# Altium schematic sheet MCU.SchDoc
size A
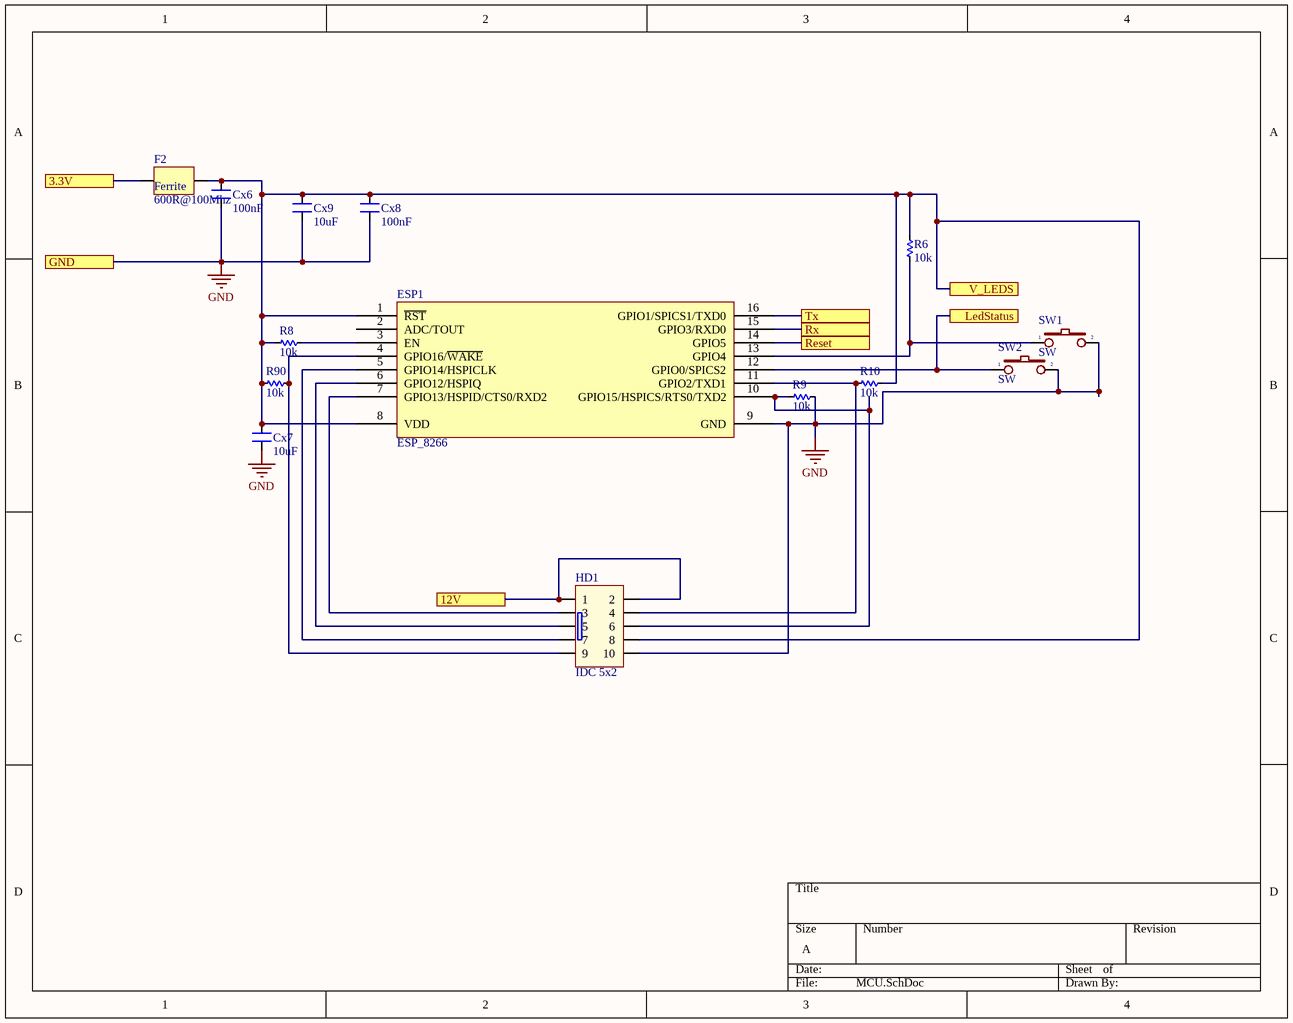
[diagram p0: MCU.SchDoc]

## Parts
Cx6  100nF  [CN-SMD-0805]
Cx7  10uF  [CN-SMD-0805]
Cx8  100nF  [CN-SMD-0805]
Cx9  10uF  [CN-SMD-0805]
ESP1  ESP_8266  [ESP12_small]
F2  600R@100Mhz  [Capacitor_805]
HD1  IDC 5x2  [IDC10-BH]
R6  10k  [RES-SMD-0805]
R8  10k  [RES-SMD-0805]
R9  10k  [RES-SMD-0805]
R10  10k  [RES-SMD-0805]
R90  10k  [RES-SMD-0805]
SW1  SW  [SW1-DIP]
SW2  SW  [SW1-SMD]

## Ports
3.3V, 12V, GND, LedStatus, Reset, Rx, Tx, V_LEDS

## Nets
GND: Cx6.1 Cx7.2 Cx8.1 Cx9.1 ESP1.9(GND) HD1.10 R9.1 SW1.2 SW2.2 ; port GND
3.3V: F2.1 ; port 3.3V
12V: HD1.1 HD1.2 ; port 12V
LedStatus: ESP1.12(GPIO0/SPICS2) SW2.1 ; port LedStatus
Reset: ESP1.14(GPIO5) ; port Reset
Rx: ESP1.15(GPIO3/RXD0) ; port Rx
Tx: ESP1.16(GPIO1/SPICS1/TXD0) ; port Tx
V_LEDS: Cx6.2 Cx7.1 Cx8.2 Cx9.2 ESP1.1(~{RST}) ESP1.8(VDD) F2.2 HD1.8 R6.1 R8.2 R10.1 R90.2 ; port V_LEDS
NetESP1_3: ESP1.3(EN) R8.1
NetESP1_4: ESP1.4(GPIO16/~{WAKE}) HD1.9 R90.1
NetESP1_5: ESP1.5(GPIO14/HSPICLK) HD1.7
NetESP1_6: ESP1.6(GPIO12/HSPIQ) HD1.5
NetESP1_7: ESP1.7(GPIO13/HSPID/CTS0/RXD2) HD1.3
NetESP1_10: ESP1.10(GPIO15/HSPICS/RTS0/TXD2) HD1.6 R9.2
NetESP1_11: ESP1.11(GPIO2/TXD1) HD1.4 R10.2
NetESP1_13: ESP1.13(GPIO4) R6.2 SW1.1

Not connected (* = marked no-connect by the designer): ESP1 2(ADC/TOUT)

## Library data of the parts
Cx6-Cx9 = CN: Value: 33pF
F2 = Ferrite
HD1 = IDC 5X2: Value: Header 5x2
R6 R8-R10 R90 = Res-SMD: Resistor; Manufacturer: Generic Components; Class: Passive; Published: 08/06/2000; Publisher: Altium Hobart Technology Centre
SW1 SW2 = SW2: Switch button 2 pin; Value: SW chip 2 pin